# Altium schematic sheet Comparator.SchDoc
size A3; Organization: Altium Limited; Address1: L3, 12a Rodborough Rd; Address2: Frenchs Forest; Address3: NSW; Address4: Australia 2086
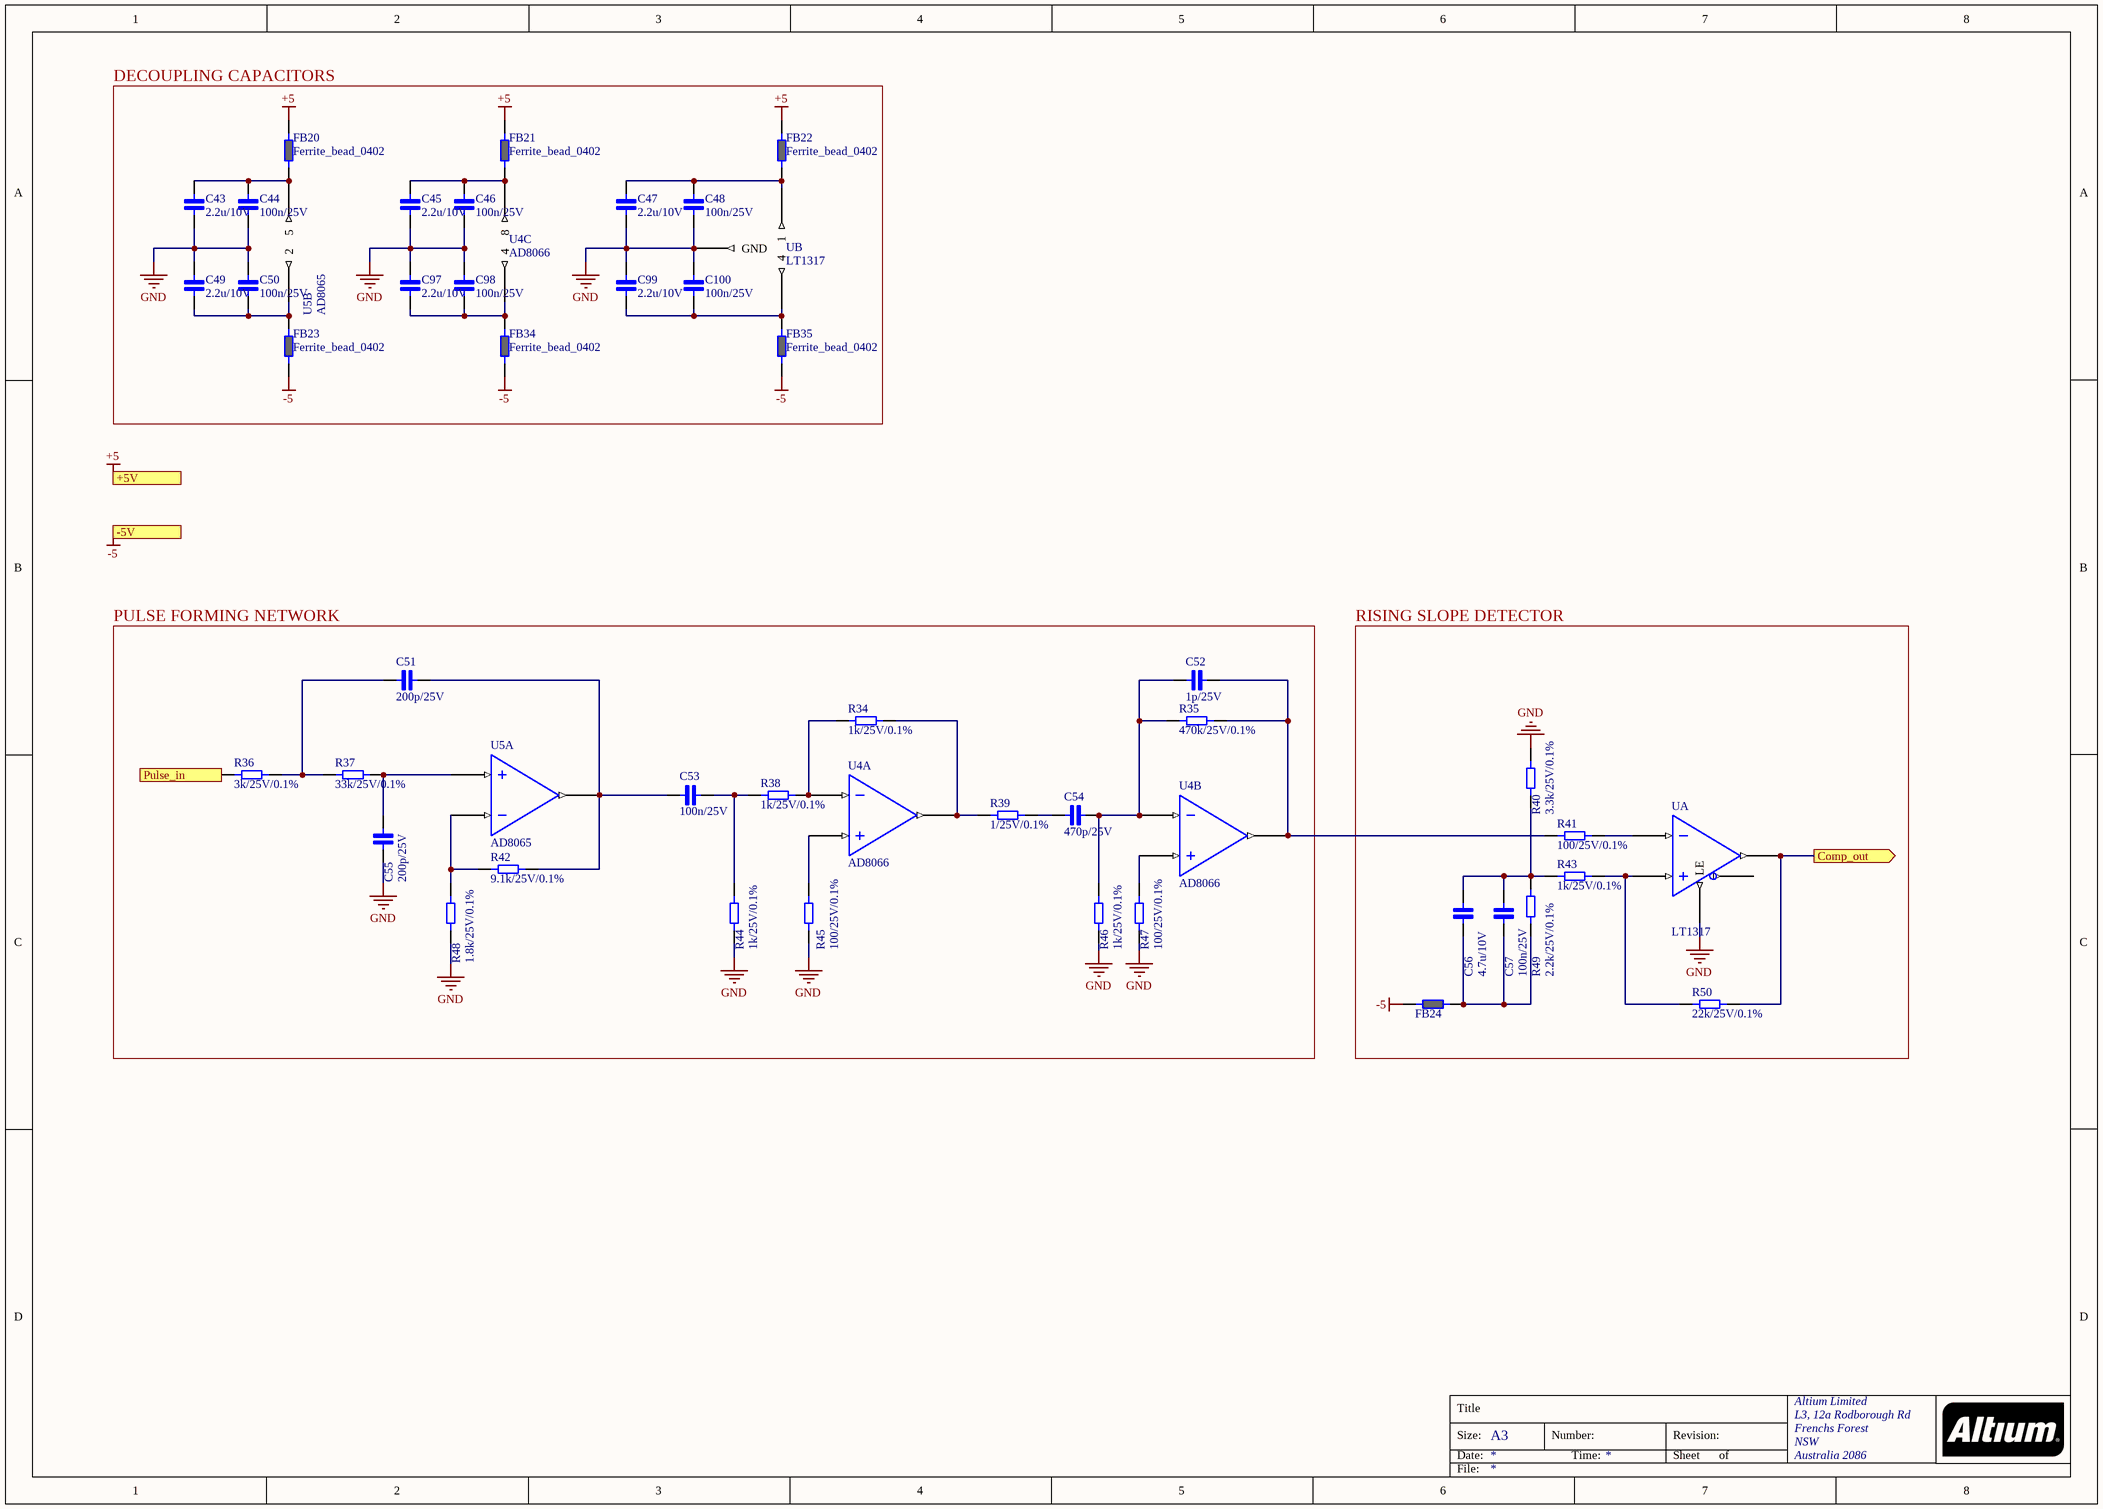
[diagram p0: Comparator.SchDoc]

## Parts
C43  2.2u/10V  [Cap_0402]
C44  100n/25V  [Cap_0402]
C45  2.2u/10V  [Cap_0402]
C46  100n/25V  [Cap_0402]
C47  2.2u/10V  [Cap_0402]
C48  100n/25V  [Cap_0402]
C49  2.2u/10V  [Cap_0402]
C50  100n/25V  [Cap_0402]
C51  200p/25V  [CAP_0603]
C52  1p/25V  [CAP_0603]
C53  100n/25V  [CAP_0603]
C54  470p/25V  [CAP_0603]
C55  200p/25V  [CAP_0603]
C56  4.7u/10V  [CAP_0603]
C57  100n/25V  [CAP_0603]
C97  2.2u/10V  [Cap_0402]
C98  100n/25V  [Cap_0402]
C99  2.2u/10V  [Cap_0402]
C100  100n/25V  [Cap_0402]
FB20  Ferrite_bead_0402  [FERRITE_0402]
FB21  Ferrite_bead_0402  [FERRITE_0402]
FB22  Ferrite_bead_0402  [FERRITE_0402]
FB23  Ferrite_bead_0402  [FERRITE_0402]
FB24  Ferrite_bead_0603  [Ferrite_0603]  (value not drawn)
FB34  Ferrite_bead_0402  [FERRITE_0402]
FB35  Ferrite_bead_0402  [FERRITE_0402]
R34  1k/25V/0.1%  [RES_0603]
R35  470k/25V/0.1%  [RES_0603]
R36  3k/25V/0.1%  [RES_0603]
R37  33k/25V/0.1%  [RES_0603]
R38  1k/25V/0.1%  [RES_0603]
R39  1/25V/0.1%  [CAP_0603]
R40  3.3k/25V/0.1%  [RES_0603]
R41  100/25V/0.1%  [RES_0603]
R42  9.1k/25V/0.1%  [RES_0603]
R43  1k/25V/0.1%  [RES_0603]
R44  1k/25V/0.1%  [RES_0603]
R45  100/25V/0.1%  [RES_0603]
R46  1k/25V/0.1%  [RES_0603]
R47  100/25V/0.1%  [RES_0603]
R48  1.8k/25V/0.1%  [RES_0603]
R49  2.2k/25V/0.1%  [RES_0603]
R50  22k/25V/0.1%  [RES_0603]
U  LT1317  [MSOP-8]  (parts A,B of 2)
U4  AD8066  [SOIC8]  (parts A,B,C of 3)
U5  AD8065  [SOT-23-5]  (parts A,B of 2)

## Blocks framed on the sheet
DECOUPLING CAPACITORS: C43-C50 C97-C100 FB20-FB23 FB34 FB35 U U4 U5
PULSE FORMING NETWORK: C51-C55 R34-R39 R42 R44-R48 U4 U5
RISING SLOPE DETECTOR: C56 C57 FB24 R40 R41 R43 R49 R50 U

## Ports
+5V (in), -5V (in), Comp_out (out), Pulse_in (in)

## Nets
+5: FB20.2 FB21.2 FB22.2 ; port +5V
-5: FB23.1 FB24.2 FB34.1 FB35.1 ; port -5V
GND: C43.1 C44.1 C45.1 C46.1 C47.1 C48.1 C49.2 C50.2 C55.1 C97.2 C98.2 C99.2 C100.2 R40.2 R44.1 R45.1 R46.1 R47.1 R48.2 U.5(LE) U.6(GND)
Comp_out: R50.2 U.7 ; port Comp_out
Pulse_in: R36.2 ; port Pulse_in
NetC43_2: C43.2 C44.2 FB20.1 U5.5
NetC45_2: C45.2 C46.2 FB21.1 U4.8
NetC47_2: C47.2 C48.2 FB22.1 U.1
NetC49_1: C49.1 C50.1 FB23.2 U5.2
NetC51_1: C51.1 R36.2 R37.2
NetC51_2: C51.2 C53.1 R42.2 U5.1
NetC52_1: C52.1 C54.2 R35.2 R46.2 U4.6
NetC52_2: C52.2 R35.2 R41.1 U4.7
NetC53_2: C53.2 R38.1 R44.2
NetC54_1: C54.1 R39.2
NetC55_2: C55.2 R37.2 U5.3
NetC56_1: C56.1 C57.2 FB24.1 R49.2
NetC56_2: C56.2 C57.1 R40.2 R43.1 R49.2
NetC97_1: C97.1 C98.1 FB34.2 U4.4
NetC99_1: C99.1 C100.1 FB35.2 U.4
NetR34_1: R34.1 R38.2 U4.2
NetR34_2: R34.2 R39.2 U4.1
NetR41_2: R41.2 U.3
NetR42_2: R42.2 R48.2 U5.4
NetR43_2: R43.2 R50.2 U.2
NetR45_2: R45.2 U4.3
NetR47_2: R47.2 U4.5

Not connected (* = marked no-connect by the designer): U 8

## Notes on the sheet
- Title
- Size:
- Date:
- A3
- Number:
- Time:
- Revision:
- Sheet
- of
- File:

## Library data of the parts
C43 C45 C47 C49 C97 C99 = Cap_0402_2.2u: Ceramic Capacitor 2.2uF / 0402 / 10V / ±5%, Wurth Elektronik MLCC
C44 C46 C48 C50 C98 C100 = Cap_0402_100n: Ceramic Capacitor 100n / 0402 / 25V / ±5%, Wurth Elektronik MLCC; ComponentLink1Description: New link; ComponentLink1URL: https://www.we-online.com/catalog/en/WCAP-CSGP-25VDC
C51 C55 = Cap_0603_200p: Ceramic Capacitor 200p / 0603 / 25V / ±5%, Wurth Elektronik MLCC; ComponentLink1Description: New link; ComponentLink1URL: https://www.we-online.com/catalog/en/WCAP-CSGP-25VDC
C52 = Cap_0603_1p: Ceramic Capacitor 1p / 0603 / 25V / ±5%, Wurth Elektronik MLCC; ComponentLink1Description: New link; ComponentLink1URL: https://www.we-online.com/catalog/en/WCAP-CSGP-25VDC
C53 C57 = Cap_0603_100n: Ceramic Capacitor 100n / 0603 / 25V / ±5%, Wurth Elektronik MLCC; ComponentLink1Description: New link; ComponentLink1URL: https://www.we-online.com/catalog/en/WCAP-CSGP-25VDC
C54 = Cap_0603_470p: Ceramic Capacitor 470p / 0603 / 25V / ±5%, Wurth Elektronik MLCC; ComponentLink1Description: New link; ComponentLink1URL: https://www.we-online.com/catalog/en/WCAP-CSGP-25VDC
C56 = Cap_0603_4.7u: Ceramic Capacitor 4.7u / 0603 / 10V / ±5%, Wurth Elektronik MLCC
FB20-FB23 FB34 FB35 = Ferrite_bead_0402: Ferrite bead, wurth 74269241102
FB24 = Ferrite_bead_0603: Ferrite bead
R34 R38 R43 R44 R46 = Res_0603_1k: Vishay, thin film resistor 1k/25V/0.1%
R35 = Res_0603_470k: Vishay, thin film resistor 470k/25V/0.1%
R36 = Res_0603_3k: Vishay, thin film resistor 3k/25V/0.1%
R37 = Res_0603_33k: Vishay, thin film resistor 33k/25V/0.1%
R39 = Res_0603_1: Vishay, thin film resistor 1/25V/0.1%
R40 = Res_0603_3.3k: Vishay, thin film resistor 3.3k/25V/0.1%
R41 R45 R47 = Res_0603_100: Vishay, thin film resistor 100/25V/0.1%
R42 = Res_0603_9.1k: Vishay, thin film resistor 9.1k/25V/0.1%
R48 = Res_0603_1.8k: Vishay, thin film resistor 1.8k/25V/0.1%
R49 = Res_0603_2.2k: Vishay, thin film resistor 2.2k/25V/0.1%
R50 = Res_0603_22k: Vishay, thin film resistor 22k/25V/0.1%
U = LT1317: Single, 7ns, Low Power, / 3V/5V/±5V Rail-to-Rail Comparators; ComponentLink1Description: New link; ComponentLink1URL: https://pl.mouser.com/ProductDetail/Analog-Devices/LT1713CMS8PBF?qs=ytflclh7QUW98nqGG0sqzA%3D%3D
U4 = AD8066: High Performance, 145 MHz / FastFET Op Amps; ComponentLink1Description: New link; ComponentLink1URL: https://pl.mouser.com/ProductDetail/Analog-Devices/AD8066ARZ-R7?qs=%2FtpEQrCGXCwSsy1qvxfKJg%3D%3D
U5 = AD8065: High Performance, 145 MHz / FastFET Op Amps; ComponentLink1Description: New link; ComponentLink1URL: https://pl.mouser.com/datasheet/2/609/AD8065_8066-1502028.pdf